# Altium schematic sheet CH552T1_CH552T.schdoc
size 127 x 101 mm
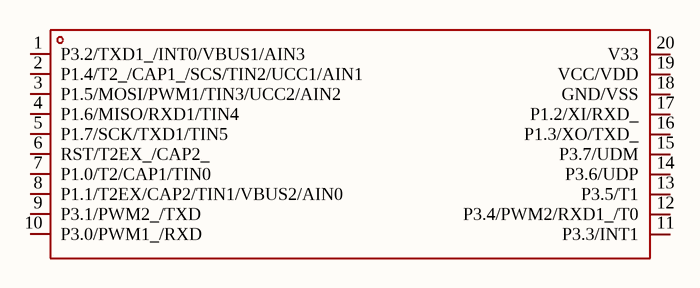
[diagram p0: CH552T1_CH552T.schdoc]

## Parts
U?  CH552T  [TSSOP-20_L6.5-W4.4-P0.65-LS6.4-BL]  (value not drawn)

## Nets

Not connected (* = marked no-connect by the designer): U? 1(P3.2/TXD1_/INT0/VBUS1/AIN3) 2(P1.4/T2_/CAP1_/SCS/TIN2/UCC1/AIN1) 3(P1.5/MOSI/PWM1/TIN3/UCC2/AIN2) 4(P1.6/MISO/RXD1/TIN4) 5(P1.7/SCK/TXD1/TIN5) 6(RST/T2EX_/CAP2_) 7(P1.0/T2/CAP1/TIN0) 8(P1.1/T2EX/CAP2/TIN1/VBUS2/AIN0) 9(P3.1/PWM2_/TXD) 10(P3.0/PWM1_/RXD) 11(P3.3/INT1) 12(P3.4/PWM2/RXD1_/T0) 13(P3.5/T1) 14(P3.6/UDP) 15(P3.7/UDM) 16(P1.3/XO/TXD_) 17(P1.2/XI/RXD_) 18(GND/VSS) 19(VCC/VDD) 20(V33)

## Library data of the parts
U? = CH552T: Manufacturer: WCH(南京沁恒); Add into BOM: yes; Symbol: CH552T; Device: CH552T; LCSC Part Name: 8位增强型USB单片机; Supplier Part: C111367; Manufacturer Part: CH552T; Supplier Footprint: TSSOP-20; JLCPCB Part Class: Extended Part; Datasheet: https://item.szlcsc.com/datasheet/CH552T/112593.html; Supplier: LCSC; Convert to PCB: yes; Applications Function: -; USB Protocol: -